# Altium schematic sheet MAX3485+TXB0108PWR.SchDoc
size A4; SheetNumber: 4; SheetTotal: 6
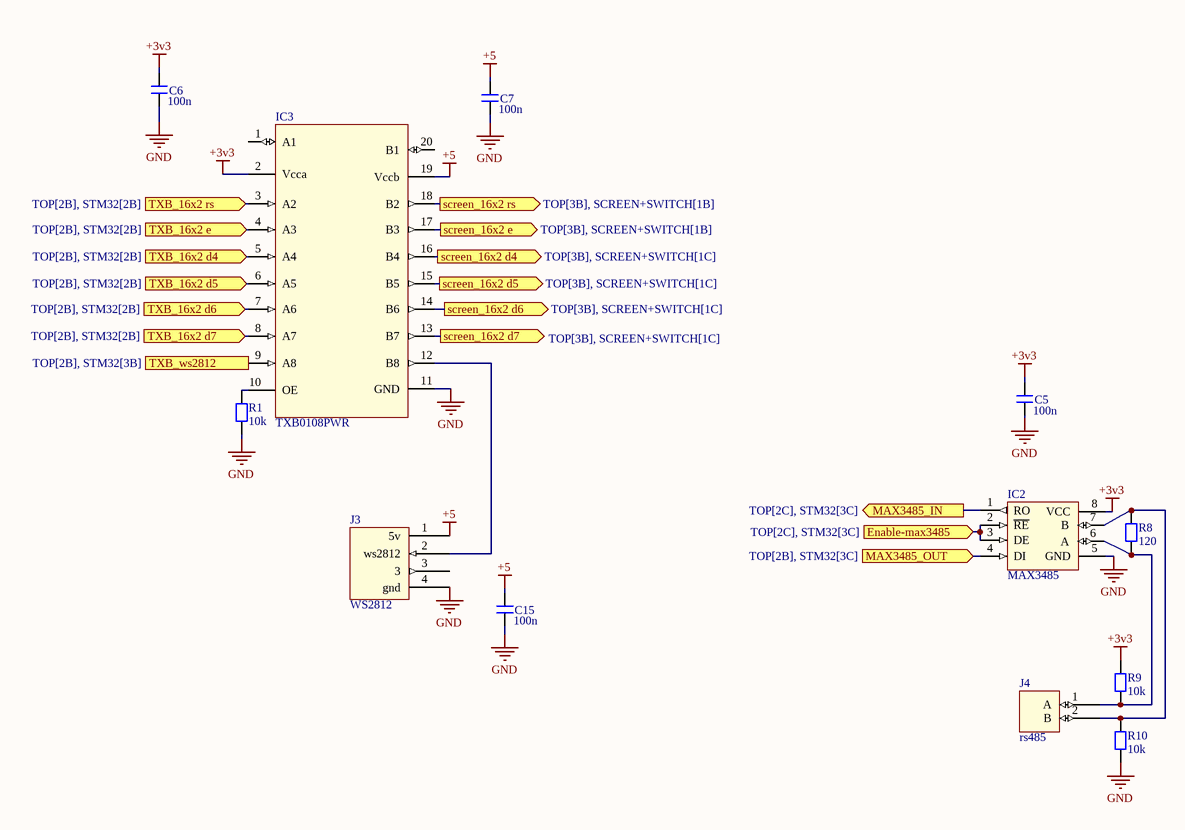
[diagram p0: MAX3485+TXB0108PWR.SchDoc]

## Parts
C5  100n  [0805]
C6  100n  [0805]
C7  100n  [0805]
C15  100n  [0805]
IC2  MAX3485  [MAX3485]
IC3  TXB0108PWR  [TXB0108PWR]
J3  WS2812  [4pinpwd]
J4  rs485  [2pin]
R1  10k  [0805]
R8  120  [0805]
R9  10k  [0805]
R10  10k  [0805]

## Ports
Enable-max3485 (in, see TOP[2C], STM32[3C]), MAX3485_IN (out, see TOP[2C], STM32[3C]), MAX3485_OUT (in, see TOP[2B], STM32[3C]), screen_16x2 d4 (out, see TOP[3B], SCREEN+SWITCH[1C]), screen_16x2 d5 (out, see TOP[3B], SCREEN+SWITCH[1C]), screen_16x2 d6 (out, see TOP[3B], SCREEN+SWITCH[1C]), screen_16x2 d7 (out, see TOP[3B], SCREEN+SWITCH[1C]), screen_16x2 e (out, see TOP[3B], SCREEN+SWITCH[1B]), screen_16x2 rs (out, see TOP[3B], SCREEN+SWITCH[1B]), TXB_16x2 d4 (in, see TOP[2B], STM32[2B]), TXB_16x2 d5 (in, see TOP[2B], STM32[2B]), TXB_16x2 d6 (in, see TOP[2B], STM32[2B]), TXB_16x2 d7 (in, see TOP[2B], STM32[2B]), TXB_16x2 e (in, see TOP[2B], STM32[2B]), TXB_16x2 rs (in, see TOP[2B], STM32[2B]), TXB_ws2812 (in, see TOP[2B], STM32[3B])

## Nets
+3v3: C5.1 C6.1 IC2.8(VCC) IC3.2(Vcca) R9.1
+5: C7.1 C15.1 IC3.19(Vccb) J3.1(5v)
GND: C5.2 C6.2 C7.2 C15.2 IC2.5(GND) IC3.11(GND) J3.4(gnd) R1.2 R10.2
Enable-max3485: IC2.2(~{RE}) IC2.3(DE) ; port Enable-max3485
MAX3485_IN: IC2.1(RO) ; port MAX3485_IN
MAX3485_OUT: IC2.4(DI) ; port MAX3485_OUT
screen_16x2 d4: IC3.16(B4) ; port screen_16x2 d4
screen_16x2 d5: IC3.15(B5) ; port screen_16x2 d5
screen_16x2 d6: IC3.14(B6) ; port screen_16x2 d6
screen_16x2 d7: IC3.13(B7) ; port screen_16x2 d7
screen_16x2 e: IC3.17(B3) ; port screen_16x2 e
screen_16x2 rs: IC3.18(B2) ; port screen_16x2 rs
TXB_16x2 d4: IC3.5(A4) ; port TXB_16x2 d4
TXB_16x2 d5: IC3.6(A5) ; port TXB_16x2 d5
TXB_16x2 d6: IC3.7(A6) ; port TXB_16x2 d6
TXB_16x2 d7: IC3.8(A7) ; port TXB_16x2 d7
TXB_16x2 e: IC3.4(A3) ; port TXB_16x2 e
TXB_16x2 rs: IC3.3(A2) ; port TXB_16x2 rs
TXB_ws2812: IC3.9(A8) ; port TXB_ws2812
NetIC2_6: IC2.6(A) J4.1(A) R8.2 R9.2
NetIC2_7: IC2.7(B) J4.2(B) R8.1 R10.1
NetIC3_10: IC3.10(OE) R1.1
NetIC3_12: IC3.12(B8) J3.2(ws2812)

Not connected (* = marked no-connect by the designer): IC3 1(A1) 20(B1); J3 3

## Library data of the parts
C5-C7 C15 = capacitor
R1 R8-R10 = resistor